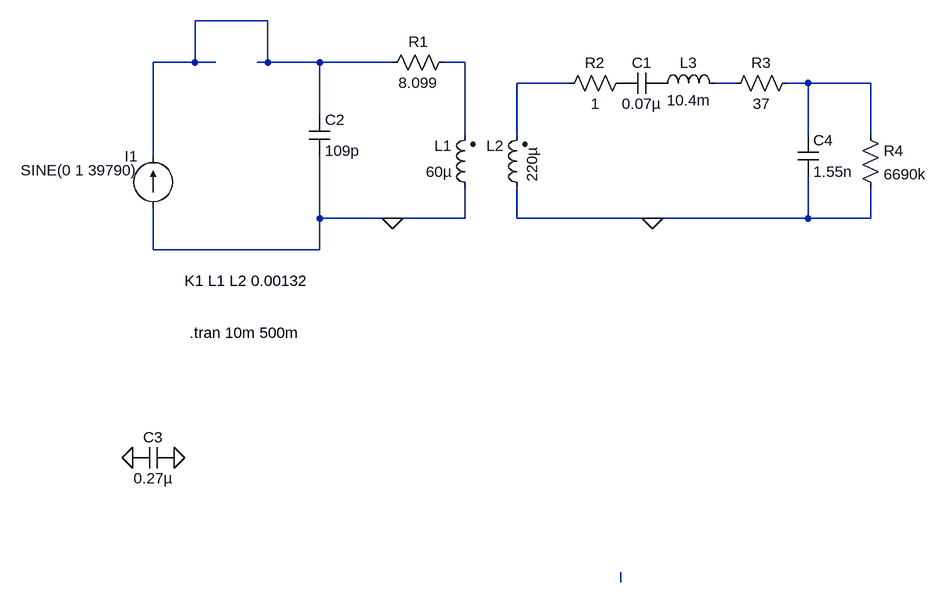
[diagram p0: schematic CoilsOnly.asc]
CoilsOnly.asc, the LTspice schematic file:
Version 4
SHEET 1 1136 1112
WIRE 64 112 -48 112
WIRE -48 176 -48 112
WIRE -48 176 -112 176
WIRE -16 176 -48 176
WIRE 64 176 64 112
WIRE 64 176 48 176
WIRE 144 176 64 176
WIRE 256 176 144 176
WIRE 368 176 336 176
WIRE 528 208 448 208
WIRE 784 208 752 208
WIRE 896 208 864 208
WIRE 992 208 896 208
WIRE 144 256 144 176
WIRE 368 288 368 176
WIRE 448 288 448 208
WIRE 896 288 896 208
WIRE 992 288 992 208
WIRE -112 320 -112 176
WIRE 144 416 144 320
WIRE 256 416 144 416
WIRE 368 416 368 368
WIRE 368 416 256 416
WIRE 448 416 448 368
WIRE 656 416 448 416
WIRE 896 416 896 352
WIRE 896 416 656 416
WIRE 992 416 992 368
WIRE 992 416 896 416
WIRE -112 464 -112 400
WIRE 144 464 144 416
WIRE 144 464 -112 464
WIRE 608 976 608 960
FLAG 256 416 0
FLAG 656 416 0
FLAG -144 784 0
FLAG -80 784 0
SYMBOL Res 624 192 R90
WINDOW 0 0 56 VBottom 2
WINDOW 3 32 56 VTop 2
SYMATTR InstName R2
SYMATTR Value 1
SYMBOL ind2 384 384 R180
WINDOW 0 36 80 Left 2
WINDOW 3 36 40 Left 2
SYMATTR InstName L1
SYMATTR Value 60µ
SYMATTR Type ind
SYMBOL ind2 464 384 R180
WINDOW 0 36 80 Left 2
WINDOW 3 -7 24 VRight 2
SYMATTR InstName L2
SYMATTR Value 220µ
SYMATTR Type ind
SYMBOL Res 976 272 R0
SYMATTR InstName R4
SYMATTR Value 6690k
SYMBOL cap 128 256 R0
SYMATTR InstName C2
SYMATTR Value 109p
SYMBOL res 352 160 R90
WINDOW 0 0 56 VBottom 2
WINDOW 3 32 56 VTop 2
SYMATTR InstName R1
SYMATTR Value 8.099
SYMBOL Cap -80 768 R90
WINDOW 0 0 32 VBottom 2
WINDOW 3 32 32 VTop 2
SYMATTR InstName C3
SYMATTR Value 0.27µ
SYMBOL current -112 400 R180
WINDOW 0 24 80 Left 2
WINDOW 3 24 58 Left 2
SYMATTR InstName I1
SYMATTR Value SINE(0 1 39790)
SYMBOL cap 672 192 R90
WINDOW 0 0 32 VBottom 2
WINDOW 3 32 32 VTop 2
SYMATTR InstName C1
SYMATTR Value 0.07µ
SYMBOL ind 656 224 R270
WINDOW 0 32 56 VTop 2
WINDOW 3 5 56 VBottom 2
SYMATTR InstName L3
SYMATTR Value 10.4m
SYMBOL Cap 880 288 R0
SYMATTR InstName C4
SYMATTR Value 1.55n
SYMBOL Res 880 192 R90
WINDOW 0 0 56 VBottom 2
WINDOW 3 32 56 VTop 2
SYMATTR InstName R3
SYMATTR Value 37
TEXT -64 512 Left 2 !K1 L1 L2 0.00132
TEXT -56 592 Left 2 !.tran 10m 500m

The netlist it stands for:
* CoilsOnly.asc
R2 P001 N003 1
L1 0 N002 60µ
L2 0 N003 220µ
R4 N005 0 6690k
C2 N001 0 109p
R1 N002 N001 8.099
C3 0 0 0.27µ
I1 0 N001 SINE(0 1 39790)
C1 P002 P001 0.07µ
L3 P002 N004 10.4m
C4 N005 0 1.55n
R3 N005 N004 37
K1 L1 L2 0.00132
.tran 10m 500m
.backanno
.end